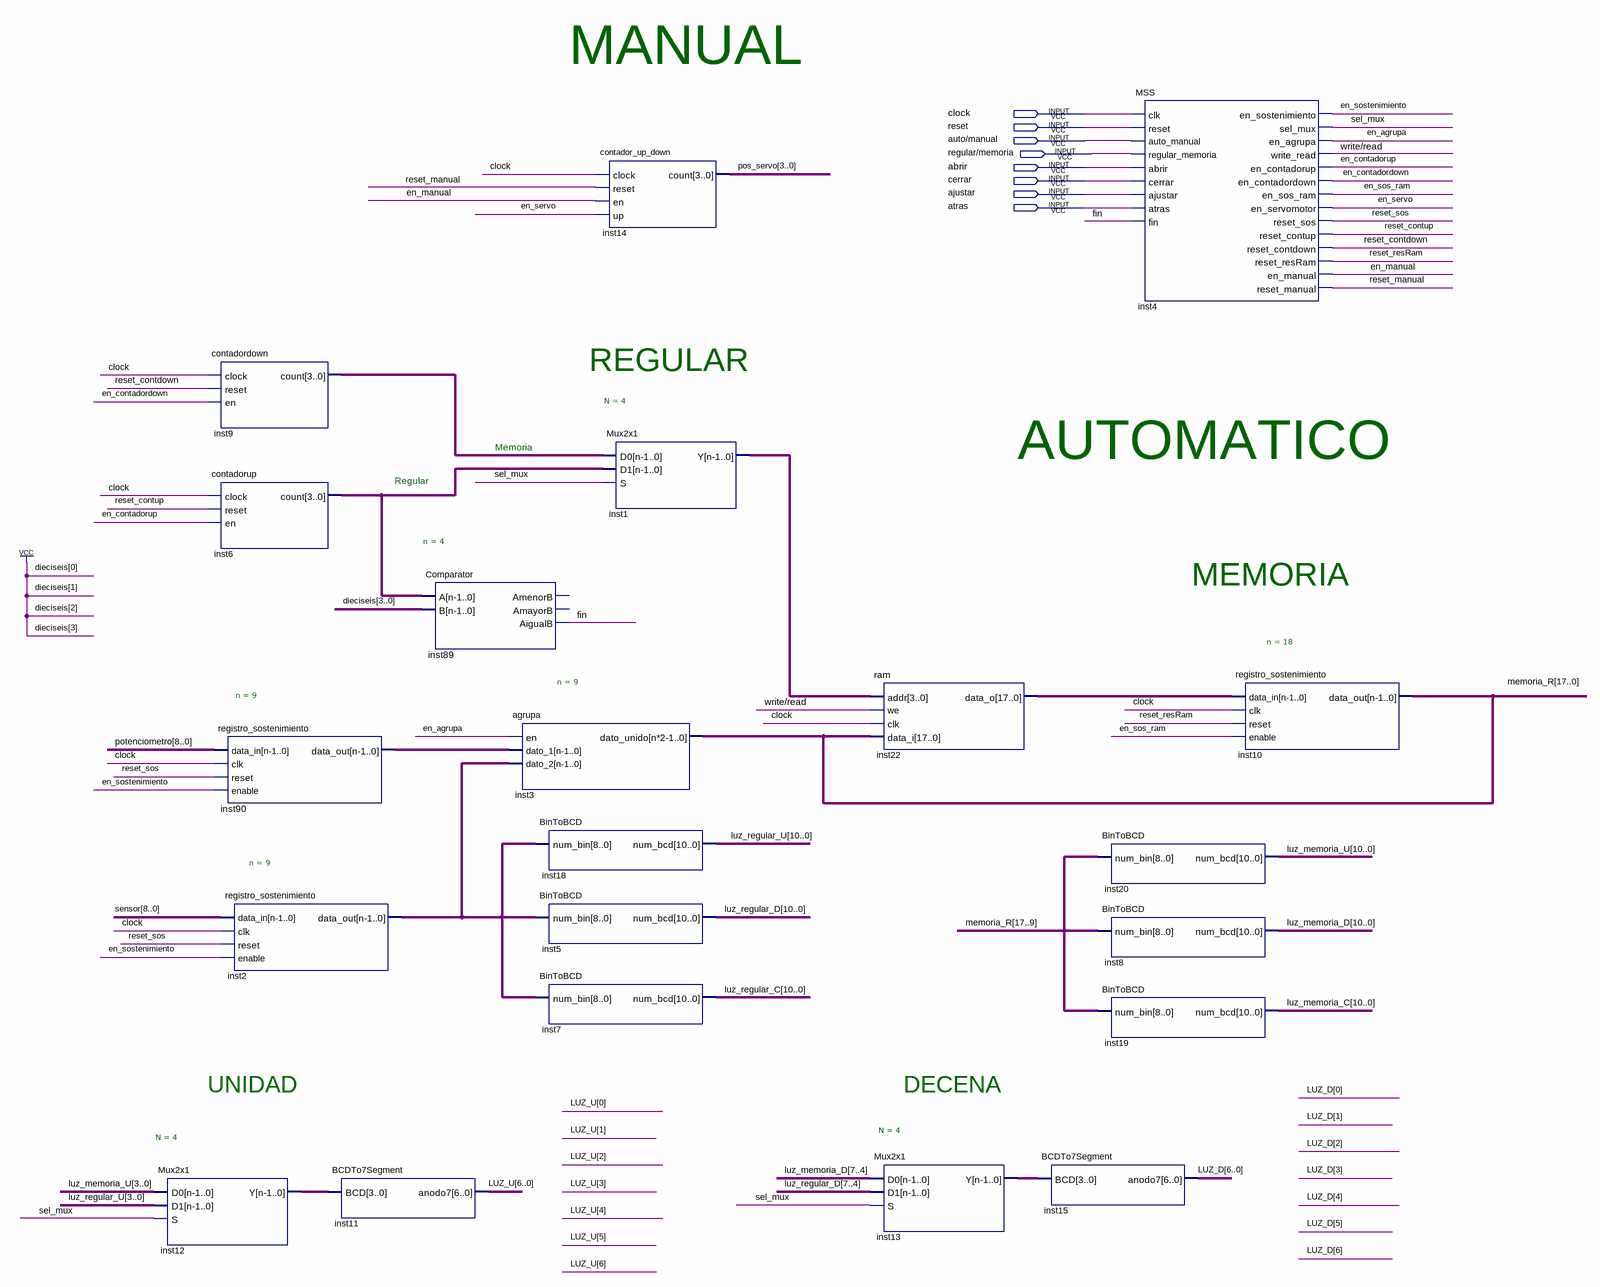
[diagram p0: schematic sheet]
// Quartus schematic proyectosd2.bdf as structural Verilog: 21 symbols, 8 pins
module proyectosd2 (
  input  clock,
  input  reset,
  input  \auto/manual ,
  input  \regular/memoria ,
  input  abrir,
  input  cerrar,
  input  ajustar,
  input  atras
);

  wire en_agrupa, en_contadordown, en_contadorup, en_manual, en_servo, en_sos_ram, en_sostenimiento, fin,
       reset_contdown, reset_contup, reset_manual, reset_resRam, reset_sos, sel_mux, \write/read ;
  wire [3:0] inst1_y, inst6_count, inst9_count, inst12_y, inst13_y, pos_servo;
  wire [6:0] LUZ_D, LUZ_U;
  wire [8:0] inst2_data_out, inst90_data_out, potenciometro, sensor;
  wire [10:0] luz_memoria_C, luz_memoria_D, luz_memoria_U, luz_regular_C, luz_regular_D, luz_regular_U;
  wire [17:0] inst22_data_o, memoria_R;

  Mux2x1 #(.N(4)) inst12 (.D0(luz_memoria_U[3:0]), .D1(luz_regular_U[3:0]), .S(sel_mux), .Y(inst12_y));
  contadordown inst9 (.clock(clock), .reset(reset_contdown), .en(en_contadordown), .count(inst9_count));
  contadorup inst6 (.clock(clock), .reset(reset_contup), .en(en_contadorup), .count(inst6_count));
  registro_sostenimiento #(.n(9)) inst90 (
    .data_in(potenciometro), .clk(clock), .reset(reset_sos), .enable(en_sostenimiento),
    .data_out(inst90_data_out));
  registro_sostenimiento #(.n(9)) inst2 (
    .data_in(sensor), .clk(clock), .reset(reset_sos), .enable(en_sostenimiento), .data_out(inst2_data_out));
  BCDTo7Segment inst11 (.BCD(inst12_y), .anodo7(LUZ_U));
  Comparator #(.n(4)) inst89 (.A(inst6_count), .B(4'b1111), .AigualB(fin));  // open: AmenorB, AmayorB
  agrupa #(.n(9)) inst3 (.en(en_agrupa), .dato_1(inst90_data_out), .dato_2(inst2_data_out), .dato_unido(memoria_R));
  BinToBCD inst18 (.num_bin(inst2_data_out), .num_bcd(luz_regular_U));
  BinToBCD inst5 (.num_bin(inst2_data_out), .num_bcd(luz_regular_D));
  BinToBCD inst7 (.num_bin(inst2_data_out), .num_bcd(luz_regular_C));
  contador_up_down inst14 (.clock(clock), .reset(reset_manual), .en(en_manual), .up(en_servo), .count(pos_servo));
  Mux2x1 #(.N(4)) inst1 (.D0(inst9_count), .D1(inst6_count), .S(sel_mux), .Y(inst1_y));
  ram inst22 (.addr(inst1_y), .we(\write/read ), .clk(clock), .data_i(memoria_R), .data_o(inst22_data_o));
  Mux2x1 #(.N(4)) inst13 (.D0(luz_memoria_D[7:4]), .D1(luz_regular_D[7:4]), .S(sel_mux), .Y(inst13_y));
  BCDTo7Segment inst15 (.BCD(inst13_y), .anodo7(LUZ_D));
  BinToBCD inst20 (.num_bin(memoria_R[17:9]), .num_bcd(luz_memoria_U));
  BinToBCD inst8 (.num_bin(memoria_R[17:9]), .num_bcd(luz_memoria_D));
  BinToBCD inst19 (.num_bin(memoria_R[17:9]), .num_bcd(luz_memoria_C));
  MSS inst4 (
    .clk(clock), .reset(reset), .auto_manual(\auto/manual ), .regular_memoria(\regular/memoria ),
    .abrir(abrir), .cerrar(cerrar), .ajustar(ajustar), .atras(atras), .fin(fin),
    .en_sostenimiento(en_sostenimiento), .sel_mux(sel_mux), .en_agrupa(en_agrupa), .write_read(\write/read ),
    .en_contadorup(en_contadorup), .en_contadordown(en_contadordown), .en_sos_ram(en_sos_ram),
    .en_servomotor(en_servo), .reset_sos(reset_sos), .reset_contup(reset_contup),
    .reset_contdown(reset_contdown), .reset_resRam(reset_resRam), .en_manual(en_manual),
    .reset_manual(reset_manual));
  registro_sostenimiento #(.n(18)) inst10 (
    .data_in(inst22_data_o), .clk(clock), .reset(reset_resRam), .enable(en_sos_ram), .data_out(memoria_R));

  // Notes on the sheet:
  //   MANUAL
  //   REGULAR
  //   AUTOMATICO
  //   Memoria
  //   Regular
  //   MEMORIA
  //   UNIDAD
  //   DECENA
endmodule
